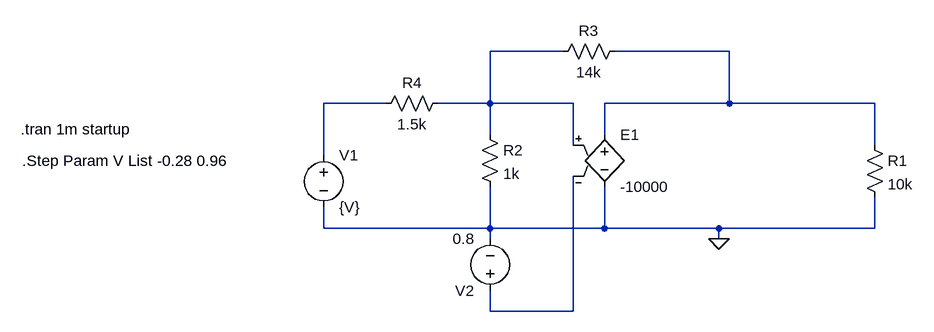
[diagram p0: schematic feedback.asc]
feedback.asc, the LTspice schematic file:
Version 4
SHEET 1 880 680
WIRE 80 -16 -32 -16
WIRE 336 -16 160 -16
WIRE -192 64 -288 64
WIRE -32 64 -32 -16
WIRE -32 64 -112 64
WIRE 96 64 -32 64
WIRE 336 64 336 -16
WIRE 336 64 144 64
WIRE 560 64 336 64
WIRE -32 112 -32 64
WIRE 144 112 144 64
WIRE 96 128 96 64
WIRE 560 128 560 64
WIRE -288 144 -288 64
WIRE -288 256 -288 224
WIRE -32 256 -32 192
WIRE -32 256 -288 256
WIRE 144 256 144 192
WIRE 144 256 -32 256
WIRE 320 256 144 256
WIRE 560 256 560 208
WIRE 560 256 320 256
WIRE -32 272 -32 256
WIRE 320 272 320 256
WIRE -32 384 -32 352
WIRE 96 384 96 176
WIRE 96 384 -32 384
FLAG 320 272 0
SYMBOL e 144 96 R0
SYMATTR InstName E1
SYMATTR Value -10000
SYMBOL res 544 112 R0
SYMATTR InstName R1
SYMATTR Value 10k
SYMBOL voltage -32 368 R180
WINDOW 123 0 0 Left 2
WINDOW 39 0 0 Left 2
SYMATTR InstName V2
SYMATTR Value 0.8
SYMBOL res -48 96 R0
SYMATTR InstName R2
SYMATTR Value 1k
SYMBOL res 176 -32 R90
WINDOW 0 0 56 VBottom 2
WINDOW 3 32 56 VTop 2
SYMATTR InstName R3
SYMATTR Value 14k
SYMBOL voltage -288 128 R0
WINDOW 123 0 0 Left 2
WINDOW 39 0 0 Left 2
SYMATTR InstName V1
SYMATTR Value {V}
SYMBOL res -96 48 R90
WINDOW 0 0 56 VBottom 2
WINDOW 3 32 56 VTop 2
SYMATTR InstName R4
SYMATTR Value 1.5k
TEXT -754 104 Left 2 !.tran 1m startup
TEXT -752 152 Left 2 !.Step Param V List -0.28 0.96

The netlist it stands for:
* feedback.asc
E1 N002 0 N001 N004 -10000
R1 N002 0 10k
V2 N004 0 0.8
R2 N001 0 1k
R3 N002 N001 14k
V1 N003 0 {V}
R4 N001 N003 1.5k
.tran 1m startup
.Step Param V List -0.28 0.96
.backanno
.end